# Altium schematic sheet FPGA_Banks_67_68_DDR32.SchDoc: Sayma AMC
size 420 x 297 mm; $$Internal___BlkDate: 0:12:25_2-9-18; $$Internal_NAME_PLACEHOLDER: a3sheet; $$Internal_Resolution: 00001mm; $$NotCommonProperty_@NAME: FPGA_XCKU040FFVA1156; $$NotCommonProperty_@PRINTORDER: 19; $$NotCommonProperty_@SHEET: FPGA Banks 67 68 DDR32; $$NotCommonProperty_@SHEETTOTAL: 30; CmpIndex: 991; Drawing Author: G.Kasprowicz; Drawing Number: Sayma AMC; Drawing Project: AMC FMC Carrier Board; Drawing Revision: 2.0; SymIndex: 2141; CheckedBy: P.Kulik,T.Przywozki,W.Ruclo; Author: G.Kasprowicz; CompanyName: WUT ISE; DrawnBy: G.Kasprowicz; Organization: WUT ISE; Address1: PW ISE; Address2: Nowowiejska 15/19 00-665 Warsaw; Address3: gkasprow@gmail.com; DocumentNumber: 27; Revision: 2; SheetNumber: 27; SheetTotal: 32; ModifiedBy: -; CheckedDate: -; Title2: FPGA banks 67 & 68; DivGrp: WUT ISE; Designer: G.Kasprowicz; ModifiedDate: -; ProjectName: Sensor Box
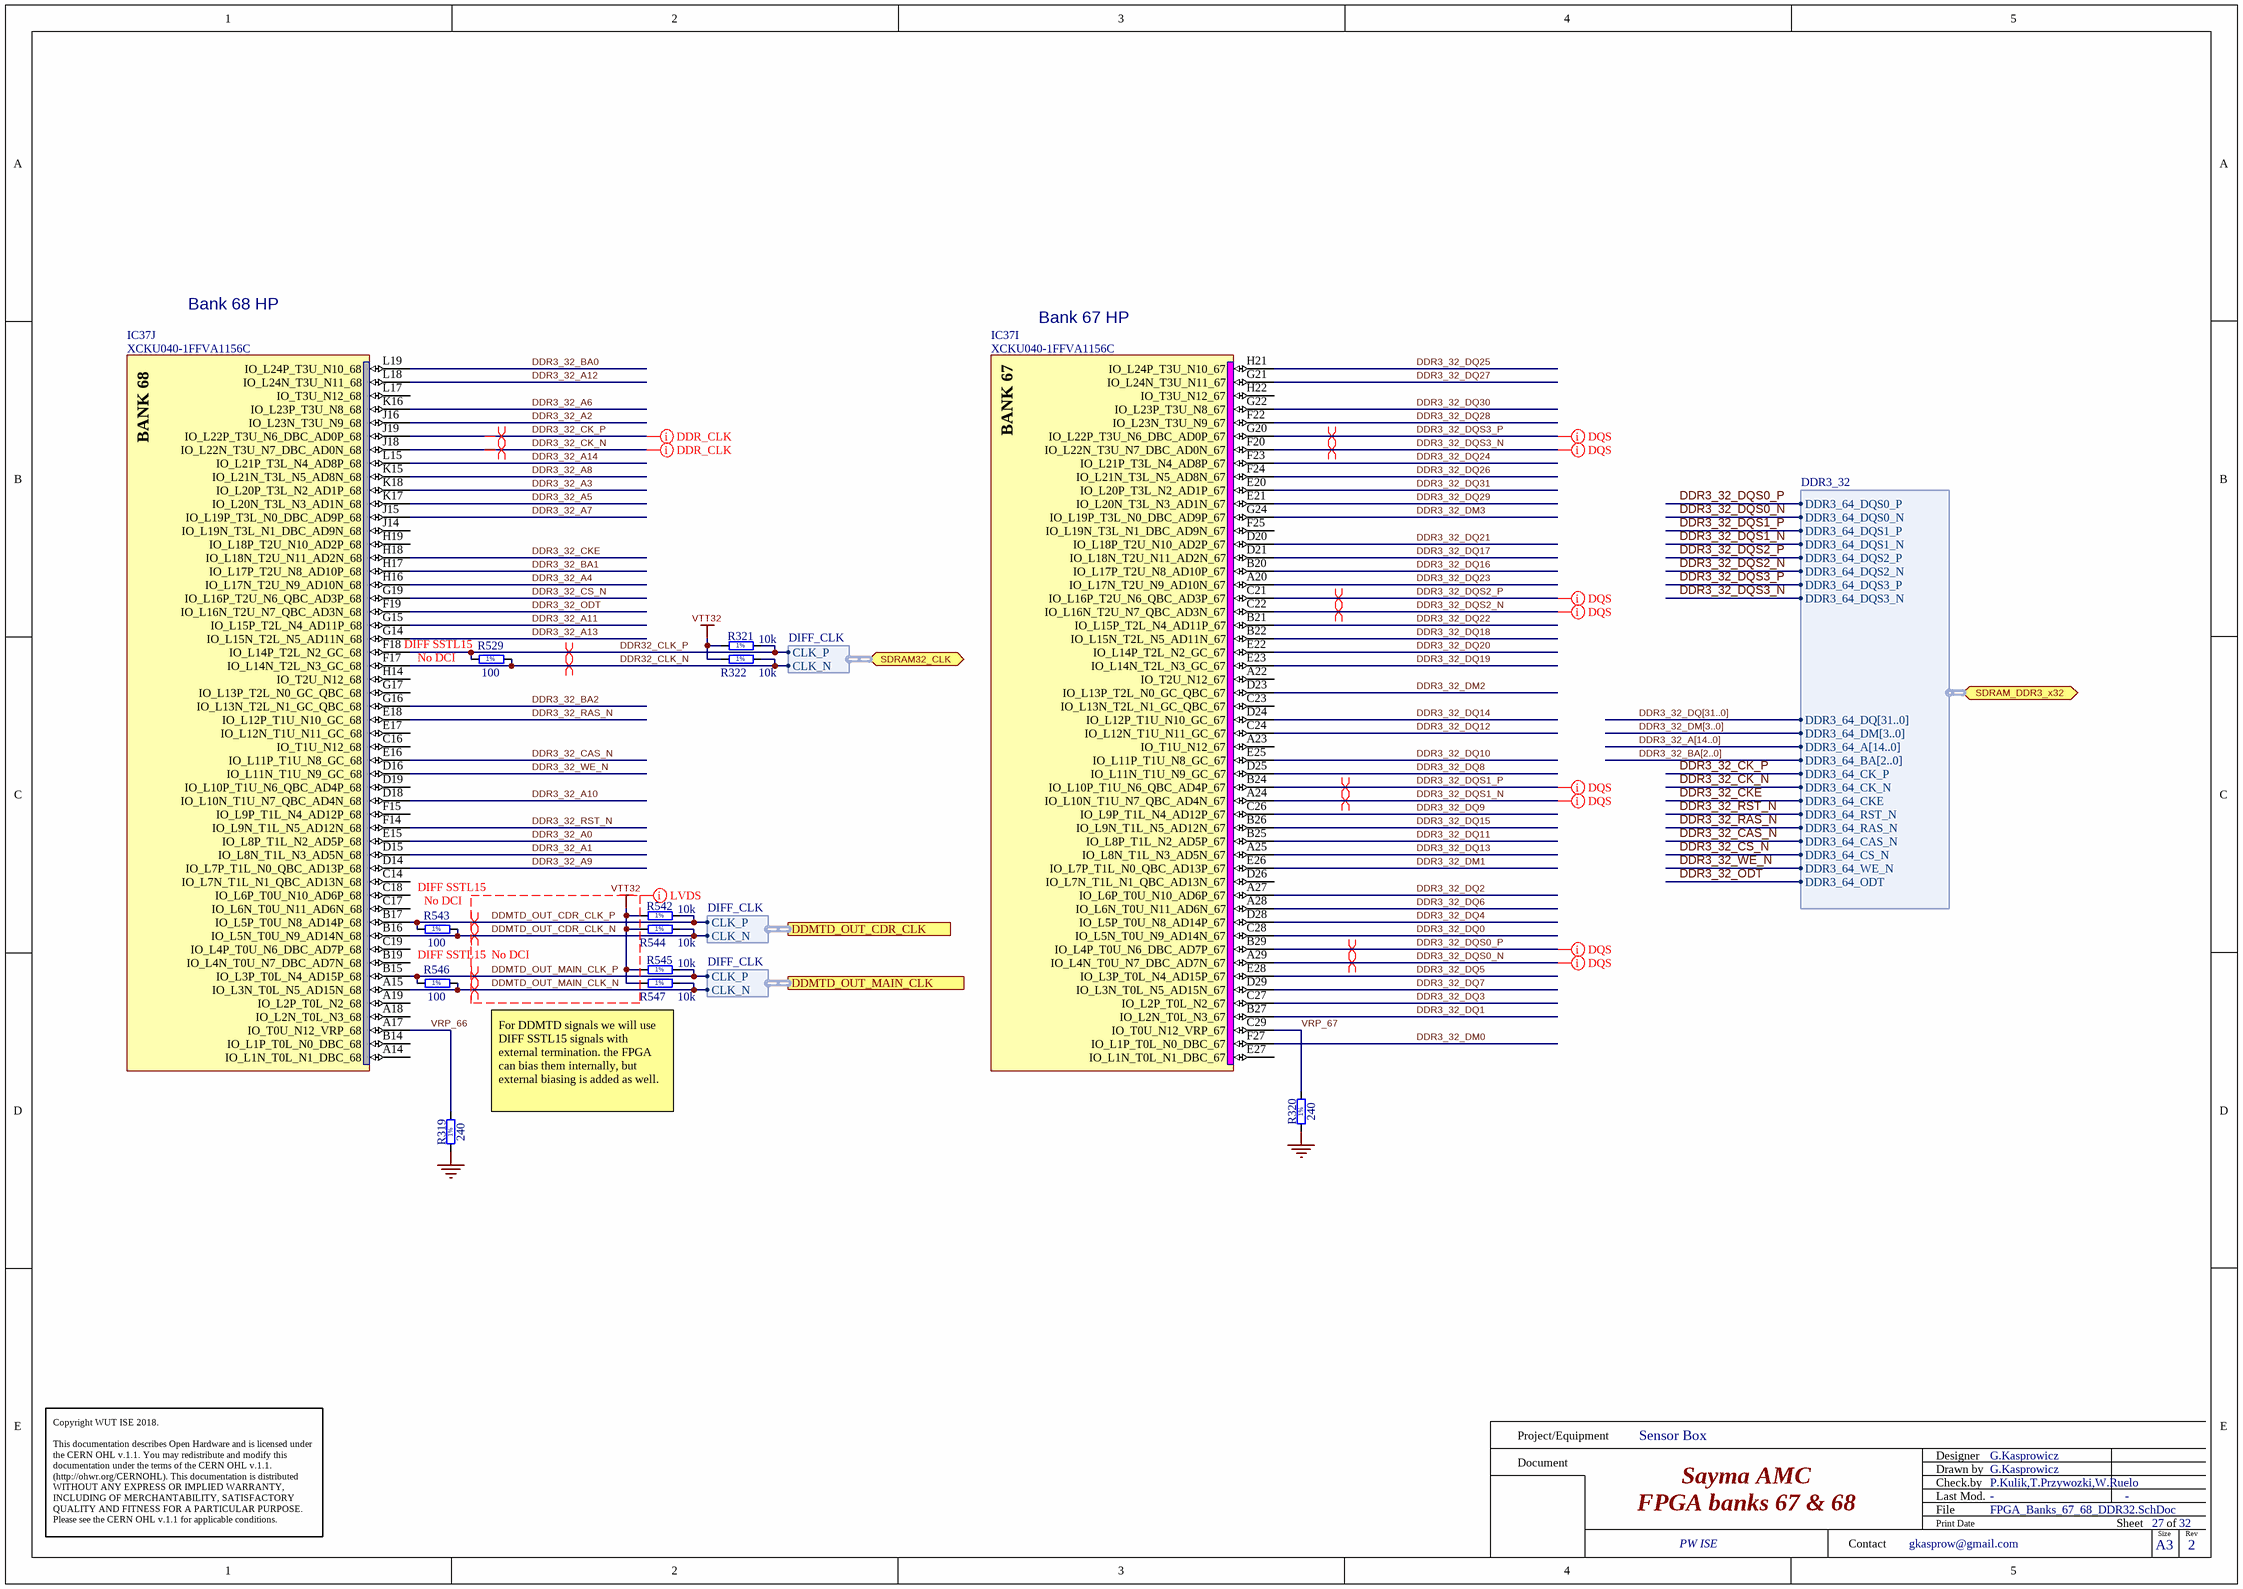
[diagram p0: FPGA_Banks_67_68_DDR32.SchDoc]

## Parts
IC37  XCKU040-1FFVA1156C  [BGA1156C100P34X34_3500X3500X350]  (parts I,J of 22)
R319  240  [RESC1005X40N]
R320  240  [RESC1005X40N]
R321  10k  [RESC1005X40N]
R322  10k  [RESC1005X40N]
R529  100  [RESC0603X28N]
R542  10k  [RESC1005X40N]
R543  100  [RESC0603X28N]
R544  10k  [RESC1005X40N]
R545  10k  [RESC1005X40N]
R546  100  [RESC0603X28N]
R547  10k  [RESC1005X40N]

## Ports
DDMTD_OUT_CDR_CLK (harness DIFF_CLK), DDMTD_OUT_MAIN_CLK (harness DIFF_CLK), SDRAM32_CLK (bidir, harness DIFF_CLK), SDRAM_DDR3_x32 (bidir, harness DDR3_32)

## Harnesses
DDR3_32: DDR3_64_DQS0_P, DDR3_64_DQS0_N, DDR3_64_DQS1_P, DDR3_64_DQS1_N, DDR3_64_DQS2_P, DDR3_64_DQS2_N, DDR3_64_DQS3_P, DDR3_64_DQS3_N, DDR3_64_DQ[31..0], DDR3_64_DM[3..0], DDR3_64_A[14..0], DDR3_64_BA[2..0], DDR3_64_CK_P, DDR3_64_CK_N, DDR3_64_CKE, DDR3_64_RST_N, DDR3_64_RAS_N, DDR3_64_CAS_N, DDR3_64_CS_N, DDR3_64_WE_N, DDR3_64_ODT
DIFF_CLK: CLK_N, CLK_P

## Nets
GND: R319.1 R320.1
VTT32: R321.1 R322.1 R542.1 R544.1 R545.1 R547.1
DDMTD_OUT_CDR_CLK_N: IC37.B16(IO_L5N_T0U_N9_AD14N_68) R543.2 R544.2 ; port DDMTD_OUT_CDR_CLK.CLK_N
DDMTD_OUT_CDR_CLK_P: IC37.B17(IO_L5P_T0U_N8_AD14P_68) R542.2 R543.1 ; port DDMTD_OUT_CDR_CLK.CLK_P
DDMTD_OUT_MAIN_CLK_N: IC37.A15(IO_L3N_T0L_N5_AD15N_68) R546.2 R547.2 ; port DDMTD_OUT_MAIN_CLK.CLK_N
DDMTD_OUT_MAIN_CLK_P: IC37.B15(IO_L3P_T0L_N4_AD15P_68) R545.2 R546.1 ; port DDMTD_OUT_MAIN_CLK.CLK_P
DDR3_32_A0: IC37.E15(IO_L8P_T1L_N2_AD5P_68)
DDR3_32_A1: IC37.D15(IO_L8N_T1L_N3_AD5N_68)
DDR3_32_A2: IC37.J16(IO_L23N_T3U_N9_68)
DDR3_32_A3: IC37.K18(IO_L20P_T3L_N2_AD1P_68)
DDR3_32_A4: IC37.H16(IO_L17N_T2U_N9_AD10N_68)
DDR3_32_A5: IC37.K17(IO_L20N_T3L_N3_AD1N_68)
DDR3_32_A6: IC37.K16(IO_L23P_T3U_N8_68)
DDR3_32_A7: IC37.J15(IO_L19P_T3L_N0_DBC_AD9P_68)
DDR3_32_A8: IC37.K15(IO_L21N_T3L_N5_AD8N_68)
DDR3_32_A9: IC37.D14(IO_L7P_T1L_N0_QBC_AD13P_68)
DDR3_32_A10: IC37.D18(IO_L10N_T1U_N7_QBC_AD4N_68)
DDR3_32_A11: IC37.G15(IO_L15P_T2L_N4_AD11P_68)
DDR3_32_A12: IC37.L18(IO_L24N_T3U_N11_68)
DDR3_32_A13: IC37.G14(IO_L15N_T2L_N5_AD11N_68)
DDR3_32_A14: IC37.L15(IO_L21P_T3L_N4_AD8P_68)
DDR3_32_BA0: IC37.L19(IO_L24P_T3U_N10_68)
DDR3_32_BA1: IC37.H17(IO_L17P_T2U_N8_AD10P_68)
DDR3_32_BA2: IC37.G16(IO_L13N_T2L_N1_GC_QBC_68)
DDR3_32_CAS_N: IC37.E16(IO_L11P_T1U_N8_GC_68) ; port SDRAM_DDR3_x32.DDR3_64_CAS_N
DDR3_32_CK_N: IC37.J18(IO_L22N_T3U_N7_DBC_AD0N_68) ; port SDRAM_DDR3_x32.DDR3_64_CK_N
DDR3_32_CK_P: IC37.J19(IO_L22P_T3U_N6_DBC_AD0P_68) ; port SDRAM_DDR3_x32.DDR3_64_CK_P
DDR3_32_CKE: IC37.H18(IO_L18N_T2U_N11_AD2N_68) ; port SDRAM_DDR3_x32.DDR3_64_CKE
DDR3_32_CS_N: IC37.G19(IO_L16P_T2U_N6_QBC_AD3P_68) ; port SDRAM_DDR3_x32.DDR3_64_CS_N
DDR3_32_DM0: IC37.F27(IO_L1P_T0L_N0_DBC_67)
DDR3_32_DM1: IC37.E26(IO_L7P_T1L_N0_QBC_AD13P_67)
DDR3_32_DM2: IC37.D23(IO_L13P_T2L_N0_GC_QBC_67)
DDR3_32_DM3: IC37.G24(IO_L19P_T3L_N0_DBC_AD9P_67)
DDR3_32_DQ0: IC37.C28(IO_L5N_T0U_N9_AD14N_67)
DDR3_32_DQ1: IC37.B27(IO_L2N_T0L_N3_67)
DDR3_32_DQ2: IC37.A27(IO_L6P_T0U_N10_AD6P_67)
DDR3_32_DQ3: IC37.C27(IO_L2P_T0L_N2_67)
DDR3_32_DQ4: IC37.D28(IO_L5P_T0U_N8_AD14P_67)
DDR3_32_DQ5: IC37.E28(IO_L3P_T0L_N4_AD15P_67)
DDR3_32_DQ6: IC37.A28(IO_L6N_T0U_N11_AD6N_67)
DDR3_32_DQ7: IC37.D29(IO_L3N_T0L_N5_AD15N_67)
DDR3_32_DQ8: IC37.D25(IO_L11N_T1U_N9_GC_67)
DDR3_32_DQ9: IC37.C26(IO_L9P_T1L_N4_AD12P_67)
DDR3_32_DQ10: IC37.E25(IO_L11P_T1U_N8_GC_67)
DDR3_32_DQ11: IC37.B25(IO_L8P_T1L_N2_AD5P_67)
DDR3_32_DQ12: IC37.C24(IO_L12N_T1U_N11_GC_67)
DDR3_32_DQ13: IC37.A25(IO_L8N_T1L_N3_AD5N_67)
DDR3_32_DQ14: IC37.D24(IO_L12P_T1U_N10_GC_67)
DDR3_32_DQ15: IC37.B26(IO_L9N_T1L_N5_AD12N_67)
DDR3_32_DQ16: IC37.B20(IO_L17P_T2U_N8_AD10P_67)
DDR3_32_DQ17: IC37.D21(IO_L18N_T2U_N11_AD2N_67)
DDR3_32_DQ18: IC37.B22(IO_L15N_T2L_N5_AD11N_67)
DDR3_32_DQ19: IC37.E23(IO_L14N_T2L_N3_GC_67)
DDR3_32_DQ20: IC37.E22(IO_L14P_T2L_N2_GC_67)
DDR3_32_DQ21: IC37.D20(IO_L18P_T2U_N10_AD2P_67)
DDR3_32_DQ22: IC37.B21(IO_L15P_T2L_N4_AD11P_67)
DDR3_32_DQ23: IC37.A20(IO_L17N_T2U_N9_AD10N_67)
DDR3_32_DQ24: IC37.F23(IO_L21P_T3L_N4_AD8P_67)
DDR3_32_DQ25: IC37.H21(IO_L24P_T3U_N10_67)
DDR3_32_DQ26: IC37.F24(IO_L21N_T3L_N5_AD8N_67)
DDR3_32_DQ27: IC37.G21(IO_L24N_T3U_N11_67)
DDR3_32_DQ28: IC37.F22(IO_L23N_T3U_N9_67)
DDR3_32_DQ29: IC37.E21(IO_L20N_T3L_N3_AD1N_67)
DDR3_32_DQ30: IC37.G22(IO_L23P_T3U_N8_67)
DDR3_32_DQ31: IC37.E20(IO_L20P_T3L_N2_AD1P_67)
DDR3_32_DQS0_N: IC37.A29(IO_L4N_T0U_N7_DBC_AD7N_67) ; port SDRAM_DDR3_x32.DDR3_64_DQS0_N
DDR3_32_DQS0_P: IC37.B29(IO_L4P_T0U_N6_DBC_AD7P_67) ; port SDRAM_DDR3_x32.DDR3_64_DQS0_P
DDR3_32_DQS1_N: IC37.A24(IO_L10N_T1U_N7_QBC_AD4N_67) ; port SDRAM_DDR3_x32.DDR3_64_DQS1_N
DDR3_32_DQS1_P: IC37.B24(IO_L10P_T1U_N6_QBC_AD4P_67) ; port SDRAM_DDR3_x32.DDR3_64_DQS1_P
DDR3_32_DQS2_N: IC37.C22(IO_L16N_T2U_N7_QBC_AD3N_67) ; port SDRAM_DDR3_x32.DDR3_64_DQS2_N
DDR3_32_DQS2_P: IC37.C21(IO_L16P_T2U_N6_QBC_AD3P_67) ; port SDRAM_DDR3_x32.DDR3_64_DQS2_P
DDR3_32_DQS3_N: IC37.F20(IO_L22N_T3U_N7_DBC_AD0N_67) ; port SDRAM_DDR3_x32.DDR3_64_DQS3_N
DDR3_32_DQS3_P: IC37.G20(IO_L22P_T3U_N6_DBC_AD0P_67) ; port SDRAM_DDR3_x32.DDR3_64_DQS3_P
DDR3_32_ODT: IC37.F19(IO_L16N_T2U_N7_QBC_AD3N_68) ; port SDRAM_DDR3_x32.DDR3_64_ODT
DDR3_32_RAS_N: IC37.E18(IO_L12P_T1U_N10_GC_68) ; port SDRAM_DDR3_x32.DDR3_64_RAS_N
DDR3_32_RST_N: IC37.F14(IO_L9N_T1L_N5_AD12N_68) ; port SDRAM_DDR3_x32.DDR3_64_RST_N
DDR3_32_WE_N: IC37.D16(IO_L11N_T1U_N9_GC_68) ; port SDRAM_DDR3_x32.DDR3_64_WE_N
DDR32_CLK_N: IC37.F17(IO_L14N_T2L_N3_GC_68) R322.2 R529.2 ; port SDRAM32_CLK.CLK_N
DDR32_CLK_P: IC37.F18(IO_L14P_T2L_N2_GC_68) R321.2 R529.1 ; port SDRAM32_CLK.CLK_P
VRP_66: IC37.A17(IO_T0U_N12_VRP_68) R319.2
VRP_67: IC37.C29(IO_T0U_N12_VRP_67) R320.2

Not connected (* = marked no-connect by the designer): IC37 A14(IO_L1N_T0L_N1_DBC_68) A18(IO_L2N_T0L_N3_68) A19(IO_L2P_T0L_N2_68) A22(IO_T2U_N12_67) A23(IO_T1U_N12_67) B14(IO_L1P_T0L_N0_DBC_68) B19(IO_L4N_T0U_N7_DBC_AD7N_68) C14(IO_L7N_T1L_N1_QBC_AD13N_68) C16(IO_T1U_N12_68) C17(IO_L6N_T0U_N11_AD6N_68) C18(IO_L6P_T0U_N10_AD6P_68) C19(IO_L4P_T0U_N6_DBC_AD7P_68) C23(IO_L13N_T2L_N1_GC_QBC_67) D19(IO_L10P_T1U_N6_QBC_AD4P_68) D26(IO_L7N_T1L_N1_QBC_AD13N_67) E17(IO_L12N_T1U_N11_GC_68) E27(IO_L1N_T0L_N1_DBC_67) F15(IO_L9P_T1L_N4_AD12P_68) F25(IO_L19N_T3L_N1_DBC_AD9N_67) G17(IO_L13P_T2L_N0_GC_QBC_68) H14(IO_T2U_N12_68) H19(IO_L18P_T2U_N10_AD2P_68) H22(IO_T3U_N12_67) J14(IO_L19N_T3L_N1_DBC_AD9N_68) L17(IO_T3U_N12_68)

## Buses and harness runs
bus DDR3_32_A[14..0]
bus DDR3_32_BA[2..0]
bus DDR3_32_DM[3..0]
bus DDR3_32_DQ[31..0]

## Layout directives
differential pair: DDMTD_OUT_CDR_CLK_N, DDMTD_OUT_CDR_CLK_P, DDMTD_OUT_MAIN_CLK_N, DDMTD_OUT_MAIN_CLK_P, DDR3_32_CK_N, DDR3_32_CK_P, DDR3_32_DQS0_N, DDR3_32_DQS0_P, DDR3_32_DQS1_N, DDR3_32_DQS1_P, DDR3_32_DQS2_N, DDR3_32_DQS2_P, DDR3_32_DQS3_N, DDR3_32_DQS3_P, DDR32_CLK_N, DDR32_CLK_P
net class LVDS: DDMTD_OUT_CDR_CLK_N, DDMTD_OUT_CDR_CLK_P, DDMTD_OUT_MAIN_CLK_N, DDMTD_OUT_MAIN_CLK_P, VTT32
net class DQS: DDR3_32_DQS0_N, DDR3_32_DQS0_P, DDR3_32_DQS1_N, DDR3_32_DQS1_P, DDR3_32_DQS2_N, DDR3_32_DQS2_P, DDR3_32_DQS3_N, DDR3_32_DQS3_P
net class DDR_CLK: DDR3_32_CK_N, DDR3_32_CK_P

## Notes on the sheet
- Bank 68 HP
- Bank 67 HP
- (near R529) DIFF SSTL15
- (near R529) No DCI
- DIFF SSTL15
- (near R543) No DCI
- No DCI
- For DDMTD signals we will use DIFF SSTL15 signals with external termination. the FPGA can bias them internally, but external biasing is added as well.
- Project/Equipment
- Document
- Designer
- Drawn by
- Check.by
- Copyright WUT ISE 2018.
  This documentation describes Open Hardware and is licensed under the CERN OHL v.1.1. You may redistribute and modify this documentation under the terms of the CERN OHL v.1.1. (http://ohwr.org/CERNOHL). This documentation is distributed WITHOUT ANY EXPRESS OR IMPLIED WARRANTY, INCLUDING OF MERCHANTABILITY, SATISFACTORY QUALITY AND FITNESS FOR A PARTICULAR PURPOSE. Please see the CERN OHL v.1.1 for applicable conditions.
- Contact
- File
- Last Mod.
- Print Date
- Sheet
- Size
- A3
- of
- Rev
- (in symbol R0201_100R_1%_0.05W_200PPM) 1%
- (in symbol R0402_10K_1%_0.0625W_100PPM) 1%
- (in symbol R0402_240R_1%_0.0625W_100PPM) 1%
- (in symbol XCKU040-1FFVA1156C, part I) BANK 67
- (in symbol XCKU040-1FFVA1156C, part J) BANK 68

## Library data of the parts
IC37 = XCKU040-1FFVA1156C: Kintex UltraScale FPGA, 520 I/O, 530K Cells, 1156-Ball BGA, Speed Grade 1, Commercial Grade; Manufacturer: XILINX; Part Description: Kintex UltraScale, 40 DLL I/O, 416 HP I/O, 104 HR I/O, 1156-Pin BGA, Speed Grade 1, Commercial Grade; PressFit: No; Bonding: No; PackageDescription: BGA, 1.00mm Pitch, Square; 1156 Pin, 34 Columns X 34 Rows, Body 35.00mm X 35.00mm X 3.50mm H, IPC Medium Density; Part Number: XCKU040-1FFVA1156C; Component Kind: Standard; Component Type: Standard; Device: XCKU040-1FFVA1156C; Manufacturer Part Number: XCKU040-1FFVA1156C; Pin Count: 1156; Case: BGA1156; Mounted: Yes; Socket: No; SMD: Yes; Sense: No; ComponentHeight: 3.5mm; HelpURL: \\cern.ch\dfs\Applications\Altium\Datasheets\XCKU040-1FFVA1156C.pdf; ComponentLink1URL: \\cern.ch\dfs\Applications\Altium\Datasheets\XCKU040-1FFVA1156C_Package-Pinout.pdf; ComponentLink1Description: Package/Pinout; Author: CERN DEM CA; CreateDate: 16.08.2016; LatestRevisionDate: 16.08.2016
R319 R320 = R0402_240R_1%_0.0625W_100PPM: Resistor - 1%; Manufacturer: GENERIC; Part Description: General Purpose Thick Film Chip Resistor; Manufacturer1 Part Number: 232270672401L; TC: ±100ppm/°C; PressFit: No; Manufacturer Part Number: R0402_240R_1%_0.0625W_100PPM; Part Number: R0402_240R_1%_0.0625W_100PPM; Tolerance: ±1%; Value: 240; Component Kind: Standard; Component Type: Standard; Pin Count: 2; Status: Not Recommended; Power: 0.0625W; Case: 0402; Mounted: Yes; Sense: No; Socket: No; SMD: Yes; Manufacturer1 Example: YAGEO PHYCOMP; Manufacturer1 ComponentHeight: 0.4mm; HelpURL: \\cern.ch\dfs\Applications\Altium\Datasheets\R0402_Phycomp_RC0402.pdf; Author: CERN DEM JLC; CreateDate: 03.12.2007; LatestRevisionDate: 17.10.2012
R321 R322 R542 R544 R545 R547 = R0402_10K_1%_0.0625W_100PPM: Resistor - 1%; Manufacturer: GENERIC; Part Description: General Purpose Thick Film Chip Resistor; Manufacturer1 Part Number: 232270671003L; TC: ±100ppm/°C; PressFit: No; Manufacturer Part Number: R0402_10K_1%_0.0625W_100PPM; Part Number: R0402_10K_1%_0.0625W_100PPM; Tolerance: ±1%; Value: 10k; Component Kind: Standard; Component Type: Standard; Pin Count: 2; Status: Not Recommended; Power: 0.0625W; Case: 0402; Mounted: Yes; Sense: No; Socket: No; SMD: Yes; Manufacturer1 Example: YAGEO PHYCOMP; Manufacturer1 ComponentHeight: 0.4mm; HelpURL: \\cern.ch\dfs\Applications\Altium\Datasheets\R0402_Phycomp_RC0402.pdf; Author: CERN DEM JLC; CreateDate: 03.12.2007; LatestRevisionDate: 17.10.2012
R529 R543 R546 = R0201_100R_1%_0.05W_200PPM: Resistor - 1%; Manufacturer: GENERIC; Part Description: Thick Film Chip Resistor; Manufacturer1 Part Number: CRCW0201100RFNED; Power: 0.05W; TC: ±200ppm/°C; PressFit: No; Manufacturer Part Number: R0201_100R_1%_0.05W_200PPM; Part Number: R0201_100R_1%_0.05W_200PPM; Tolerance: ±1%; Value: 100; Component Kind: Standard; Component Type: Standard; Pin Count: 2; Status: Not Recommended; Case: 0201; Mounted: Yes; Sense: No; Socket: No; SMD: Yes; Manufacturer1 Example: VISHAY; Manufacturer1 ComponentHeight: 0.27mm; HelpURL: \\cern.ch\dfs\Applications\Altium\Datasheets\R0201_VISHAY_CRCW0201 e3.pdf; Author: CERN DEM JLC; CreateDate: 13.11.2014; LatestRevisionDate: 13.11.2014